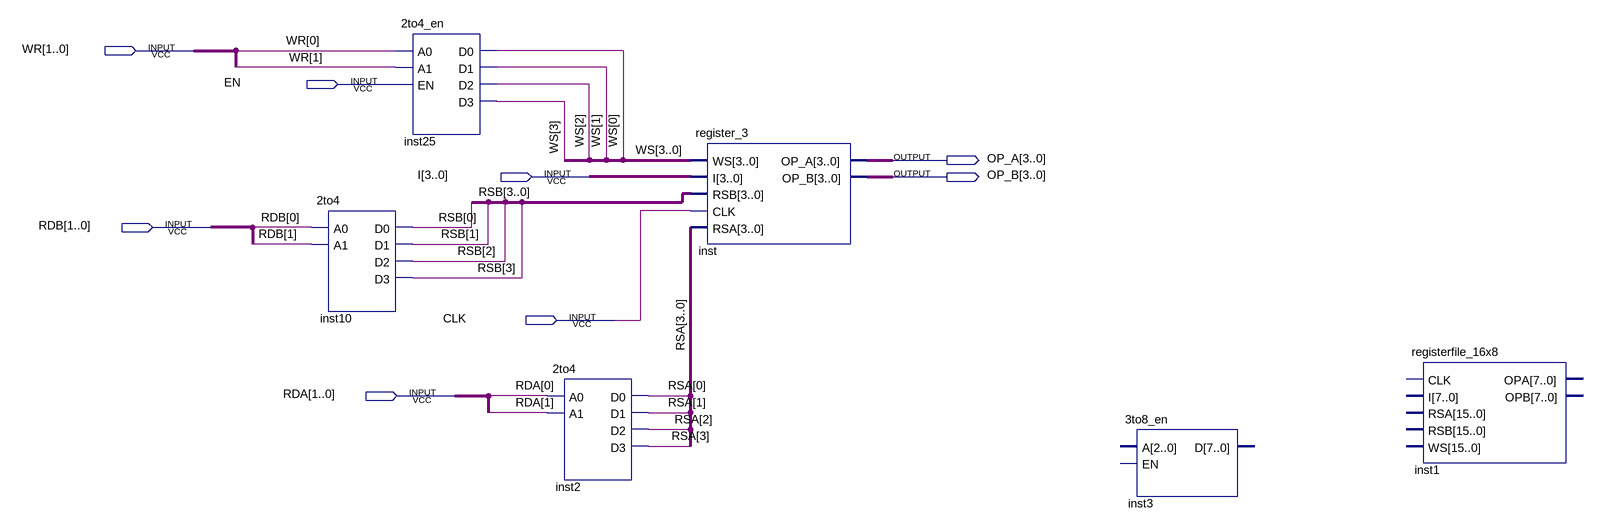
[diagram p0: schematic sheet]
// Quartus schematic register_file.bdf as structural Verilog: 6 symbols, 8 pins
module register_file (
  input  [1:0] WR,
  input  EN,
  input  [3:0] I,
  input  [1:0] RDB,
  input  CLK,
  input  [1:0] RDA,
  output [3:0] OP_A,
  output [3:0] OP_B
);

  wire [3:0] RSA, RSB, WS;

  \2to4  inst10 (.A0(RDB[0]), .A1(RDB[1]), .D0(RSB[0]), .D1(RSB[1]), .D2(RSB[2]), .D3(RSB[3]));
  \2to4_en  inst25 (.A0(WR[0]), .A1(WR[1]), .EN(EN), .D0(WS[0]), .D1(WS[1]), .D2(WS[2]), .D3(WS[3]));
  \2to4  inst2 (.A0(RDA[0]), .A1(RDA[1]), .D0(RSA[0]), .D1(RSA[1]), .D2(RSA[2]), .D3(RSA[3]));
  register_3 inst (.WS(WS), .I(I), .RSB(RSB), .CLK(CLK), .RSA(RSA), .OP_A(OP_A), .OP_B(OP_B));
  \3to8_en  inst3 ();  // open: A, EN, D
  registerfile_16x8 inst1 ();  // open: CLK, I, RSA, RSB, WS, OPA, OPB
endmodule
